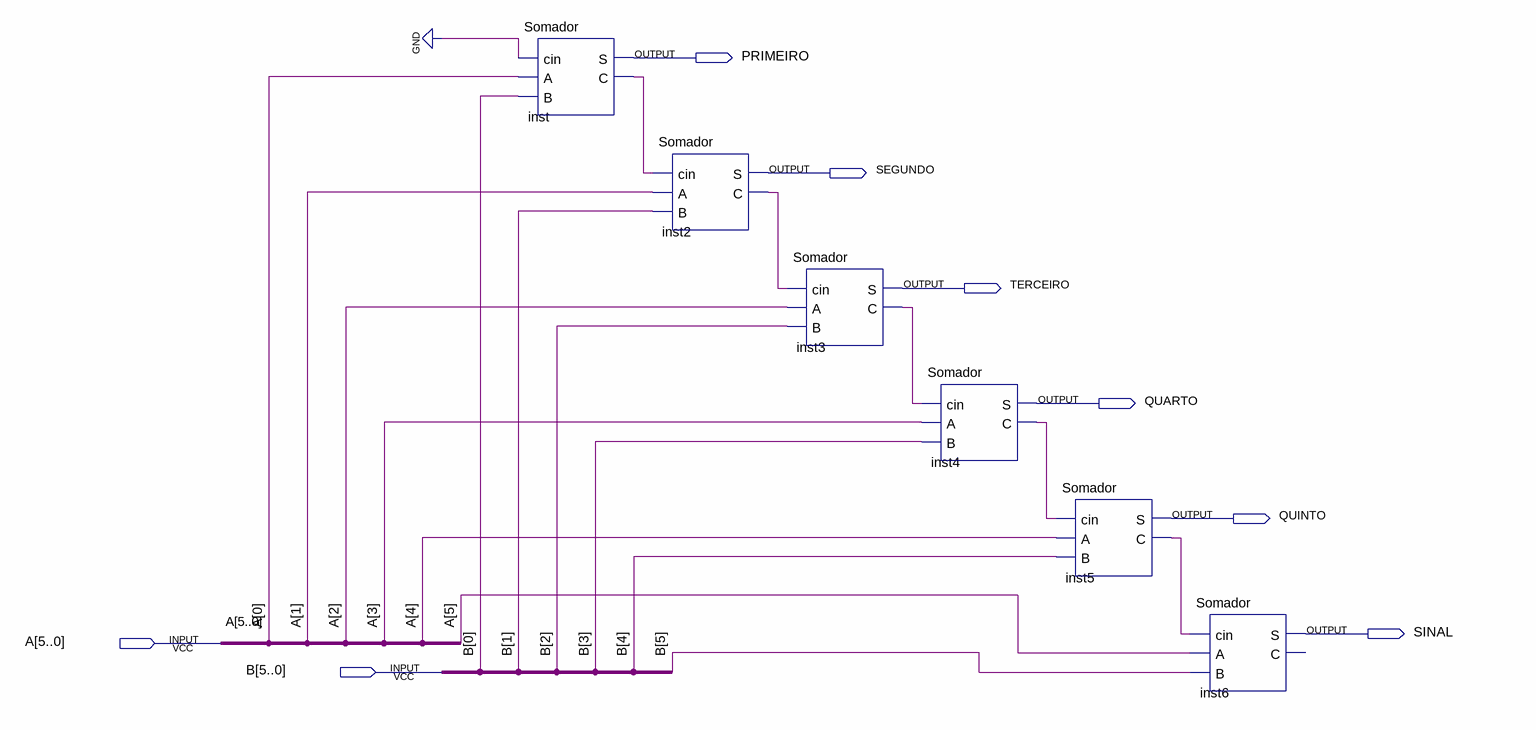
[diagram p0: schematic sheet]
// Quartus schematic SomadorSeisBits.bdf as structural Verilog: 6 symbols, 8 pins
module SomadorSeisBits (
  input  [5:0] A,
  input  [5:0] B,
  output PRIMEIRO,
  output SEGUNDO,
  output TERCEIRO,
  output QUARTO,
  output QUINTO,
  output SINAL
);

  wire inst2_c, inst3_c, inst4_c, inst5_c, inst_c;

  Somador inst (.cin(1'b0), .A(A[0]), .B(B[0]), .S(PRIMEIRO), .C(inst_c));
  Somador inst2 (.cin(inst_c), .A(A[1]), .B(B[1]), .S(SEGUNDO), .C(inst2_c));
  Somador inst3 (.cin(inst2_c), .A(A[2]), .B(B[2]), .S(TERCEIRO), .C(inst3_c));
  Somador inst4 (.cin(inst3_c), .A(A[3]), .B(B[3]), .S(QUARTO), .C(inst4_c));
  Somador inst5 (.cin(inst4_c), .A(A[4]), .B(B[4]), .S(QUINTO), .C(inst5_c));
  Somador inst6 (.cin(inst5_c), .A(A[5]), .B(B[5]), .S(SINAL));  // open: C
endmodule
